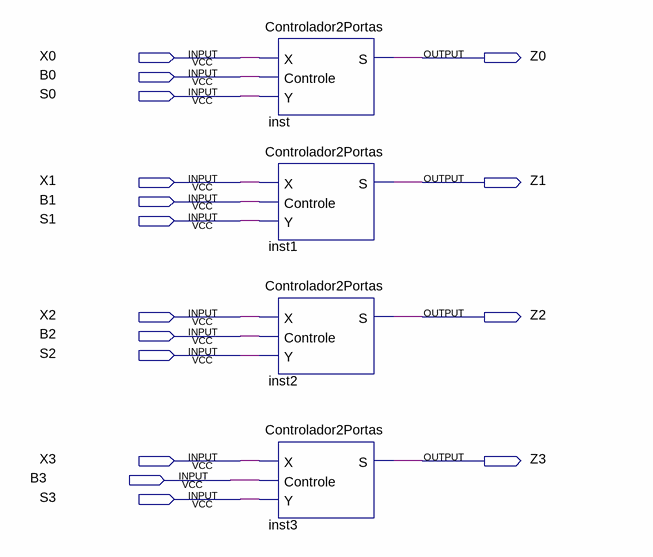
[diagram p0: schematic sheet]
// Quartus schematic Controlador4Bits.bdf as structural Verilog: 4 symbols, 16 pins
module Controlador4Bits (
  input  X0,
  input  B0,
  input  S0,
  input  X1,
  input  B1,
  input  S1,
  input  X2,
  input  B2,
  input  S2,
  input  X3,
  input  B3,
  input  S3,
  output Z0,
  output Z1,
  output Z2,
  output Z3
);

  Controlador2Portas inst (.X(X0), .Controle(B0), .Y(S0), .S(Z0));
  Controlador2Portas inst1 (.X(X1), .Controle(B1), .Y(S1), .S(Z1));
  Controlador2Portas inst2 (.X(X2), .Controle(B2), .Y(S2), .S(Z2));
  Controlador2Portas inst3 (.X(X3), .Controle(B3), .Y(S3), .S(Z3));
endmodule
